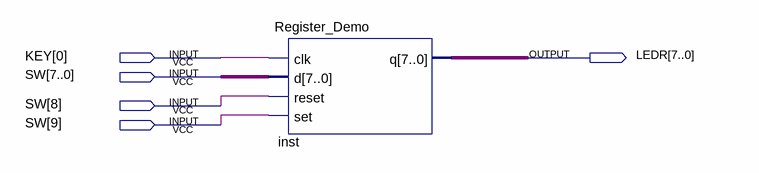
[diagram p0: schematic sheet]
// Quartus schematic aaaaaaaaaaaaaaaah.bdf as structural Verilog: 1 symbols, 5 pins
module aaaaaaaaaaaaaaaah (
  input  [0:0] KEY,
  input  [9:0] SW,
  output [7:0] LEDR
);

  Register_Demo inst (.clk(KEY[0]), .d(SW[7:0]), .reset(SW[8]), .set(SW[9]), .q(LEDR));
endmodule
